# EasyEDA Pro project camara-detection.eprj, schematic 2_p1_camera&sd&LCD
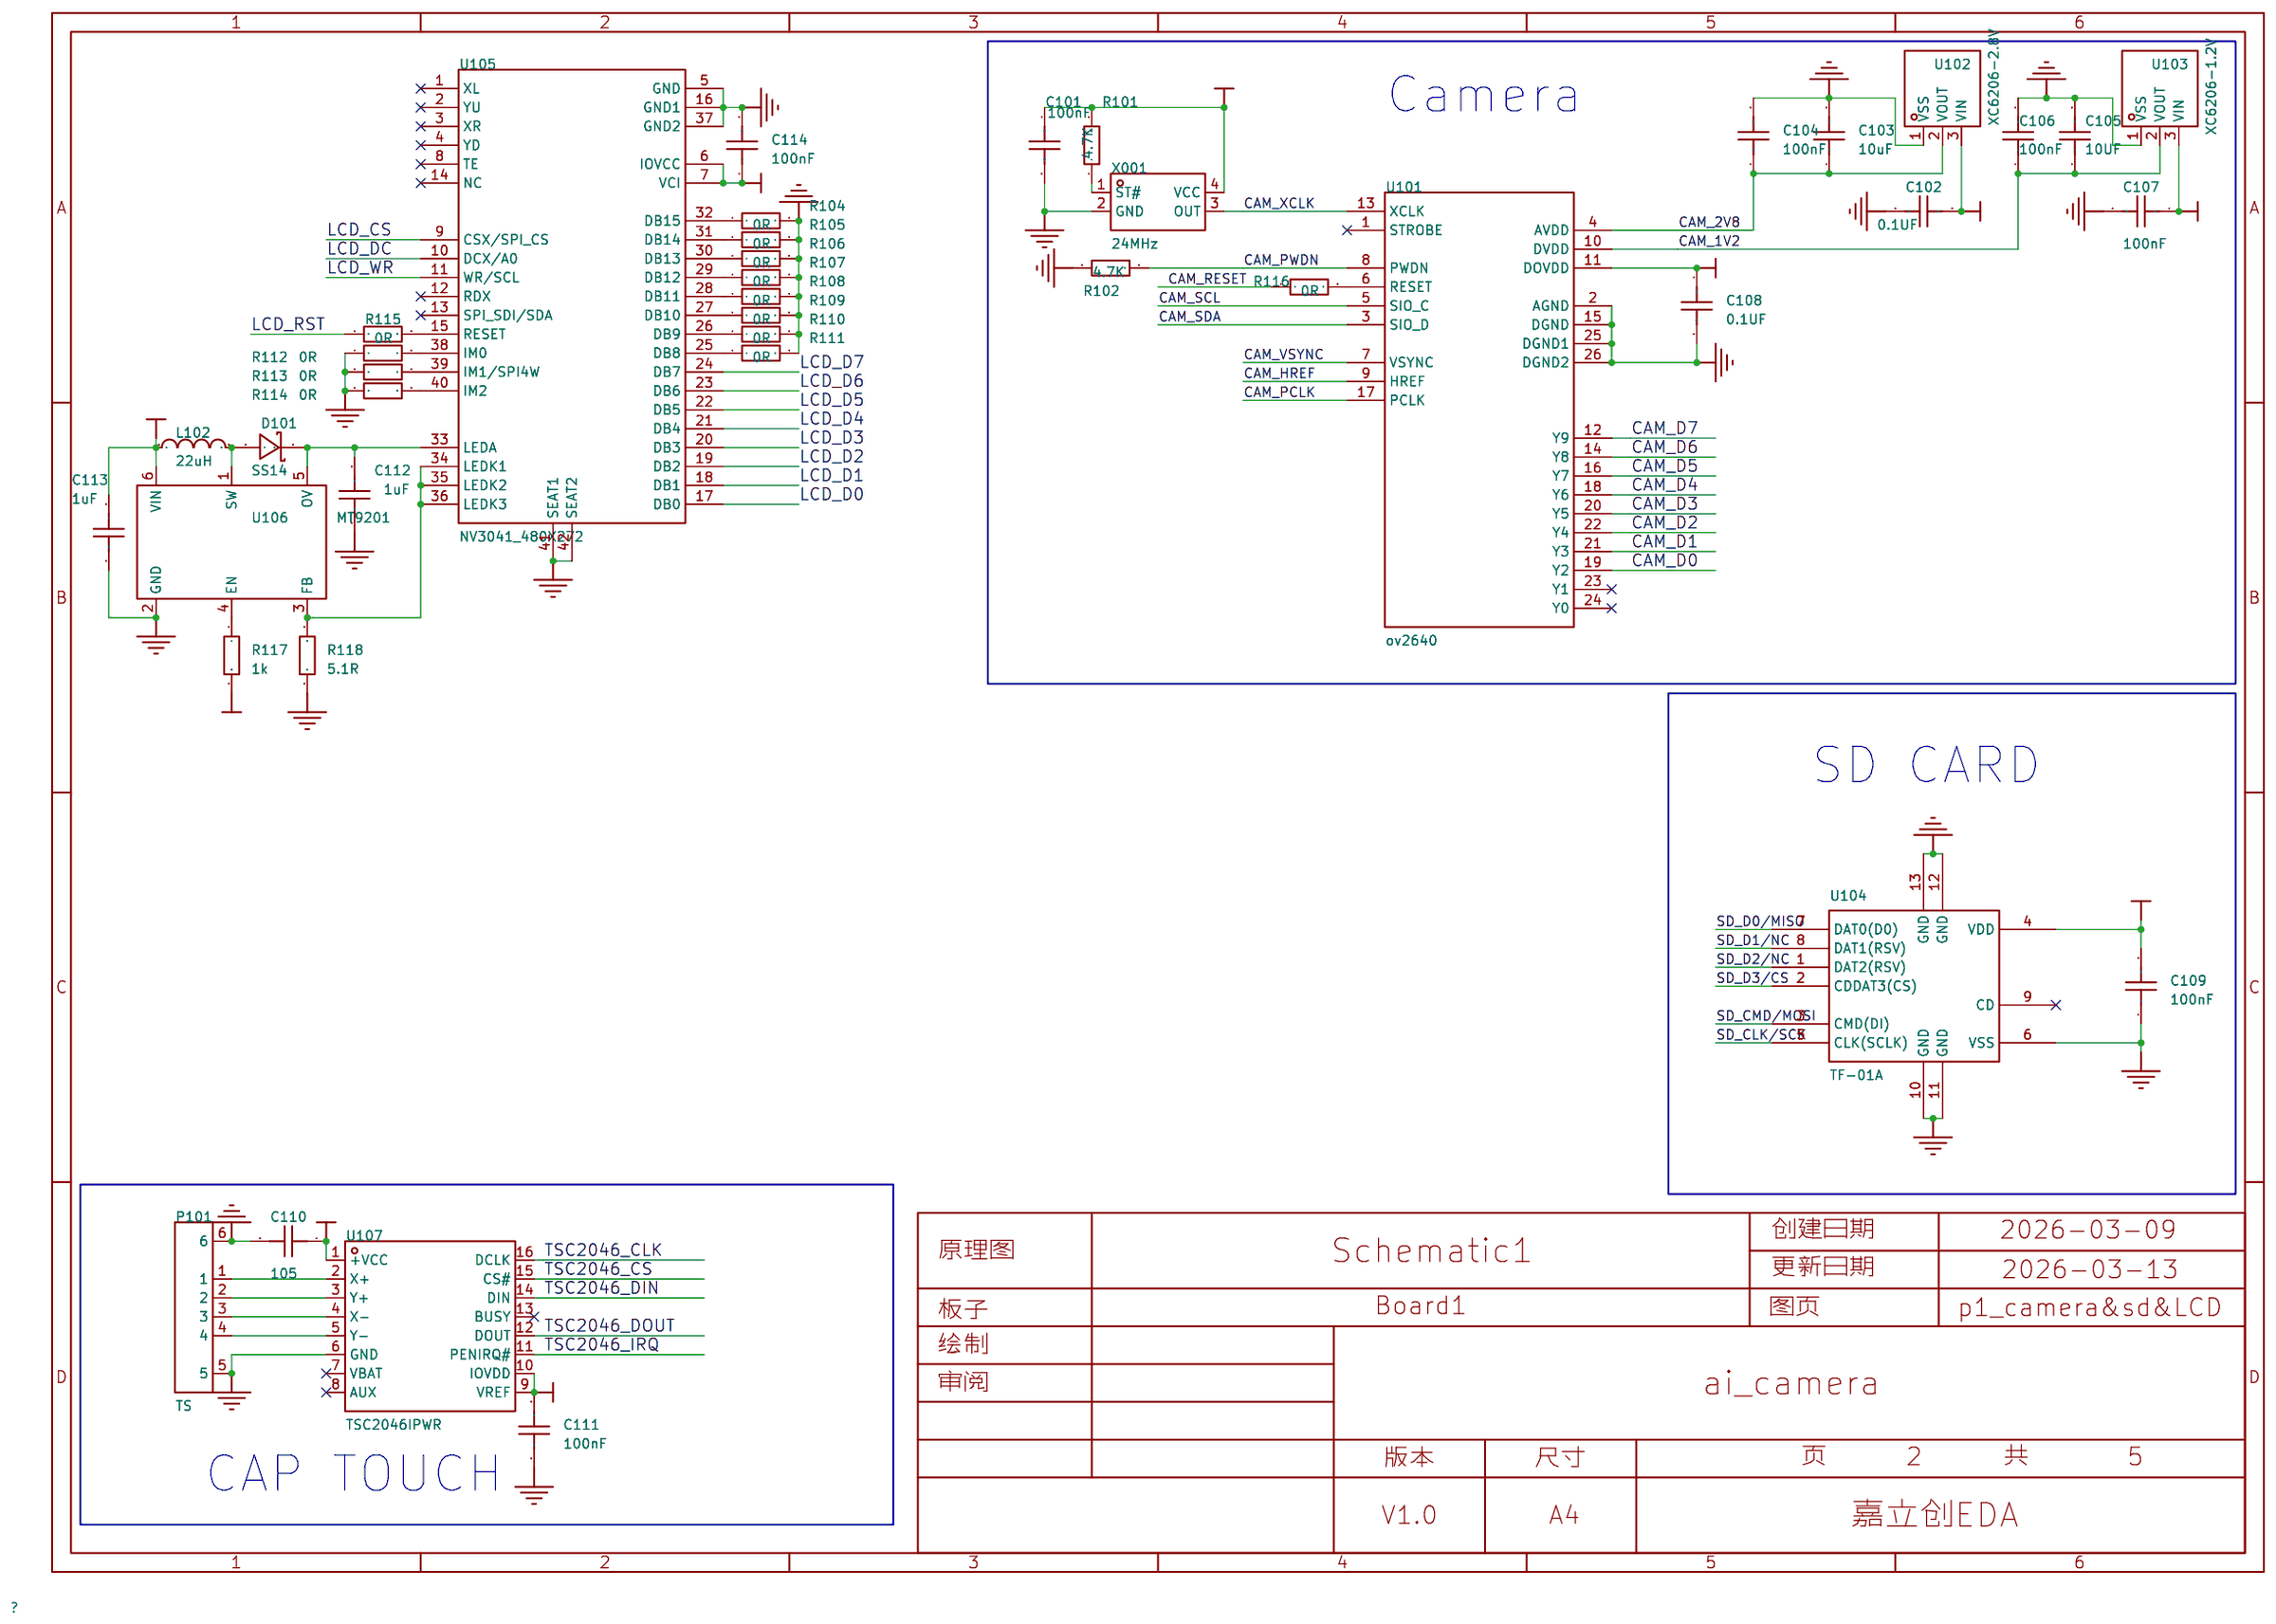
[diagram p1: schematic sheet]

## Parts
C101  100nF  [C0603]
C102  0.1UF  [C0603]
C103  10uF  [C0603]
C104  100nF  [C0603]
C105  10UF  [C0603]
C106  100nF  [C0603]
C107  0.1UF  [C0603]
C108  0.1UF  [C0603]
C109  100nF  [C0603]
C110  105  [C0805]
C111  100nF  [C0603]
C112  100nF  [C0603]
C113  100nF  [C0603]
C114  100nF  [C0603]
D101  SS14  [SMA_L4.3-W2.6-LS5.2-RD]
L102  22uH  [IND-SMD_L4.0-W4.0]
P101  TS
R101  10K  [R0603]
R102  10K  [R0603]
R104  10K  [R0603]
R105  10K  [R0603]
R106  10K  [R0603]
R107  10K  [R0603]
R108  10K  [R0603]
R109  10K  [R0603]
R110  10K  [R0603]
R111  10K  [R0603]
R112  10K  [R0603]
R113  10K  [R0603]
R114  10K  [R0603]
R115  10K  [R0603]
R116  10K  [R0603]
R117  10K  [R0603]
R118  10K  [R0603]
U101  ov2640  [FPC-SMD_P0.50-24P_FGS-XJ-H2.0]
U102  XC6206-2.8V  [SOT-23-3_L2.9-W1.6-P1.90-LS2.8-BR]
U103  XC6206-1.2V  [SOT-23-3_L2.9-W1.6-P1.90-LS2.8-BR]
U104  TF-01A  [TF-SMD_TF-01A]
U105  NV3041_480X272  [FPC-SMD_AFC07-S40FCA-00]
U106  MT9201  [SOT-23-6_L2.9-W1.6-P0.95-LS2.8-BR]
U107  TSC2046IPWR  [TSSOP-16_L5.0-W4.4-P0.65-LS6.4-BL]
X001  24MHz  [OSC-SMD_4P-L3.2-W2.5-BL]

## Library data of the parts
C101-C109 C112-C114 = CAP_0603: Supplier Footprint: 0603
C110 = CGA0805X5R106K250MT: LCSC Part Name: 10uF ±10% 25V; Manufacturer: HRE(芯声); Supplier Footprint: 0805; JLCPCB Part Class: Extended Part; Supplier: LCSC; Tolerance: ±10%; Voltage Rating: 25V; Temperature Coefficient: X5R
C111 = CGA0603X7R104K500JT: LCSC Part Name: 100nF ±10% 50V; Supplier Part: C6119867; Manufacturer: HRE(芯声); Supplier Footprint: 0603; JLCPCB Part Class: 扩展库; Datasheet: https://item.szlcsc.com/datasheet/CGA0603X7R104K500JT/7062573.html; Supplier: LCSC; Tolerance: ±10%; Voltage Rating: 50V; Temperature Coefficient: X7R
D101 = SS14_C84343: LCSC Part Name: 40V 1A 550mV@1A; Supplier Part: C84343; Manufacturer: 星海; Supplier Footprint: SMA(DO-214AC); JLCPCB Part Class: Extended Part; Datasheet: https://atta.szlcsc.com/upload/public/pdf/source/20161024/1477288629719.pdf; Supplier: LCSC; Reverse Voltage (Vr): 40V; Average Rectified Current (Io): 1A; Forward Voltage (Vf@If): 550mV@1A
L102 = YNR4030-220M: LCSC Part Name: 22uH ±20% 1A 225mΩ; Supplier Part: C341013; Manufacturer: YJYCOIN(益嘉源); Supplier Footprint: SMD,4x4x3mm; JLCPCB Part Class: Extended Part; Datasheet: https://atta.szlcsc.com/upload/public/pdf/source/20200623/C340386_9AA10DB3E9692149FF2BB278AFBCE083.pdf; Supplier: LCSC; Tolerance: ±20%; Rated Current: 1A; DC Resistance (DCR): 225mΩ
P101 = AFA07-S04ECA-00: LCSC Part Name: 间距:1mm P数:4P 抽屉式 上接; Supplier Part: C262731; Manufacturer: JS(钜硕电子); Supplier Footprint: SMD,P=1mm,卧贴; JLCPCB Part Class: 扩展库; Datasheet: https://item.szlcsc.com/datasheet/AFA07-S04ECA-00/253990.html; Supplier: LCSC; Locking Feature: 抽屉式; Contact Type: 上接; Number of Contacts: 4P; Pitch: 1mm; Mounting Type: 卧贴; FFC, FCB Thickness: 0.3mm; Height Above Board: 2.5mm
R101 R102 R104-R118 = Res_0603: Supplier Footprint: 0603
U101 = ov2640
U102 U103 = XC6206-2.8V: Supplier Part: C2892669; Manufacturer: YONGYUTAI(永裕泰); Supplier Footprint: SOT-23-3L; JLCPCB Part Class: 扩展库; Datasheet: https://atta.szlcsc.com/upload/public/pdf/source/20210901/DE3C77F0CE73FFE8F7C655BE9B94CB06.pdf; Supplier: LCSC; Output Type: 固定; Output Polarity: 正; Number of Outputs: 1; Maximum Input Voltage: 6V; Output Voltage: 2.8V; Output Current: 250mA; Operating Temperature: -40℃~+85℃@(Tj)
U104 = TF-01A_C91145: Supplier Part: C91145; Manufacturer: 韩国韩荣; Supplier Footprint: SMD; JLCPCB Part Class: 扩展库; Datasheet: https://atta.szlcsc.com/upload/public/pdf/source/20190322/C91145_63CBD6FB4639A3A3EC6A9721F18AE0FB.pdf; Supplier: LCSC; Connector Type: 卡座; Card Type: MicroSD卡(TF卡); Card Connection Mode: 自弹式
U105 = NV3041_480X272
U106 = MT9201
U107 = TSC2046IPWR: LCSC Part Name: TSC2046 触摸屏控制器; Supplier Part: C8954; Manufacturer: TI(德州仪器); Supplier Footprint: TSSOP-16; JLCPCB Part Class: 扩展库; Datasheet: https://www.ti.com/cn/lit/gpn/tsc2046; Supplier: LCSC; Touch Screen Type: 4 线电阻式; Resolution (Bits): 12位; Interface: QSPI；SPI; Voltage - Supply: 2V~5.25V; Throughput Rate: 125kHz; Operating Temperature: -40℃~+85℃
X001 = Q33310F70049000: LCSC Part Name: SG-310SCF 24MHZ 3.3V -40~+85℃ L; Supplier Part: C32528; Manufacturer: EPSON(爱普生); Supplier Footprint: SMD-3225_4P; JLCPCB Part Class: Extended Part; Datasheet: https://atta.szlcsc.com/upload/public/pdf/source/20161110/1478747427028.pdf; Supplier: LCSC; Voltage - Supply: 3.3V; Current - Supply (Max): 2.5mA; Operating Temperature: -40℃~85℃

## Nets
+3V3: C101.1 C102.2 C107.1 C108.1 C109.2 C110.1 C111.2 C114.1 R101.2 R117.2 U101.11(DOVDD) U102.3(VIN) U103.3(VIN) U104.4(VDD) U105.6(IOVCC) U105.7(VCI) U107.1(+VCC) U107.9(VREF) U107.10(IOVDD) X001.4(VCC)
+5V: C113.2 L102.1 U106.6(VIN)
GND: C101.2 C102.1 C103.2 C104.2 C105.2 C106.2 C107.2 C108.2 C109.1 C110.2 C111.1 C112.1 C113.1 C114.2 P101.5 P101.6 R102.2 R104.2 R105.2 R106.2 R107.2 R108.2 R109.2 R110.2 R111.2 R112.1 R113.1 R114.1 R118.1 U101.2(AGND) U101.15(DGND) U101.25(DGND1) U101.26(DGND2) U102.1(VSS) U103.1(VSS) U104.6(VSS) U104.10(GND) U104.11(GND) U104.12(GND) U104.13(GND) U105.5(GND) U105.16(GND1) U105.37(GND2) U105.41(SEAT1) U105.42(SEAT2) U106.2(GND) U107.6(GND) X001.2(GND)
CAM_1V2: C105.1 C106.1 U101.10(DVDD) U103.2(VOUT)
CAM_2V8: C103.1 C104.1 U101.4(AVDD) U102.2(VOUT)
CAM_D0: U101.19(Y2)
CAM_D1: U101.21(Y3)
CAM_D2: U101.22(Y4)
CAM_D3: U101.20(Y5)
CAM_D4: U101.18(Y6)
CAM_D5: U101.16(Y7)
CAM_D6: U101.14(Y8)
CAM_D7: U101.12(Y9)
CAM_HREF: U101.9(HREF)
CAM_PCLK: U101.17(PCLK)
CAM_PWDN: R102.1 U101.8(PWDN)
CAM_RESET: R116.1
CAM_SCL: U101.5(SIO_C)
CAM_SDA: U101.3(SIO_D)
CAM_VSYNC: U101.7(VSYNC)
CAM_XCLK: U101.13(XCLK) X001.3(OUT)
LCD_CS: U105.9(CSX/SPI_CS)
LCD_D0: U105.17(DB0)
LCD_D1: U105.18(DB1)
LCD_D2: U105.19(DB2)
LCD_D3: U105.20(DB3)
LCD_D4: U105.21(DB4)
LCD_D5: U105.22(DB5)
LCD_D6: U105.23(DB6)
LCD_D7: U105.24(DB7)
LCD_DC: U105.10(DCX/A0)
LCD_RST: R115.1
LCD_WR: U105.11(WR/SCL)
SD_CLK/SCK: U104.5(CLK(SCLK))
SD_CMD/MOSI: U104.3(CMD(DI))
SD_D0/MISO: U104.7(DAT0(D0))
SD_D1/NC: U104.8(DAT1(RSV))
SD_D2/NC: U104.1(DAT2(RSV))
SD_D3/CS: U104.2(CDDAT3(CS))
TSC2046_CLK: U107.16(DCLK)
TSC2046_CS: U107.15(CS#)
TSC2046_DIN: U107.14(DIN)
TSC2046_DOUT: U107.12(DOUT)
TSC2046_IRQ: U107.11(PENIRQ#)
Net-(C112-2): C112.2 D101.1(K) U105.33(LEDA) U106.5(OV)
Net-(D101-2): D101.2(A) L102.2 U106.1(SW)
Net-(P101-1): P101.1 U107.2(X+)
Net-(P101-2): P101.2 U107.3(Y+)
Net-(P101-3): P101.3 U107.4(X-)
Net-(P101-4): P101.4 U107.5(Y-)
Net-(R101-1): R101.1 X001.1(ST#)
Net-(R104-1): R104.1 U105.32(DB15)
Net-(R105-1): R105.1 U105.31(DB14)
Net-(R106-1): R106.1 U105.30(DB13)
Net-(R107-1): R107.1 U105.29(DB12)
Net-(R108-1): R108.1 U105.28(DB11)
Net-(R109-1): R109.1 U105.27(DB10)
Net-(R110-1): R110.1 U105.26(DB9)
Net-(R111-1): R111.1 U105.25(DB8)
Net-(R112-2): R112.2 U105.38(IM0)
Net-(R113-2): R113.2 U105.39(IM1/SPI4W)
Net-(R114-2): R114.2 U105.40(IM2)
Net-(R115-2): R115.2 U105.15(RESET)
Net-(R116-2): R116.2 U101.6(RESET)
Net-(R117-1): R117.1 U106.4(EN)
Net-(R118-2): R118.2 U105.34(LEDK1) U105.35(LEDK2) U105.36(LEDK3) U106.3(FB)

Not connected (* = marked no-connect by the designer): U101 1(STROBE)* 23(Y1)* 24(Y0)*; U104 9(CD)*; U105 1(XL)* 2(YU)* 3(XR)* 4(YD)* 8(TE)* 12(RDX)* 13(SPI_SDI/SDA)* 14(NC)*; U107 7(VBAT)* 8(AUX)* 13(BUSY)*

## Notes on the sheet
- Camera
- SD CARD
- CAP TOUCH
